# Altium schematic sheet ZB1.SchDoc
size A3; SheetNumber: 1; SheetTotal: 3
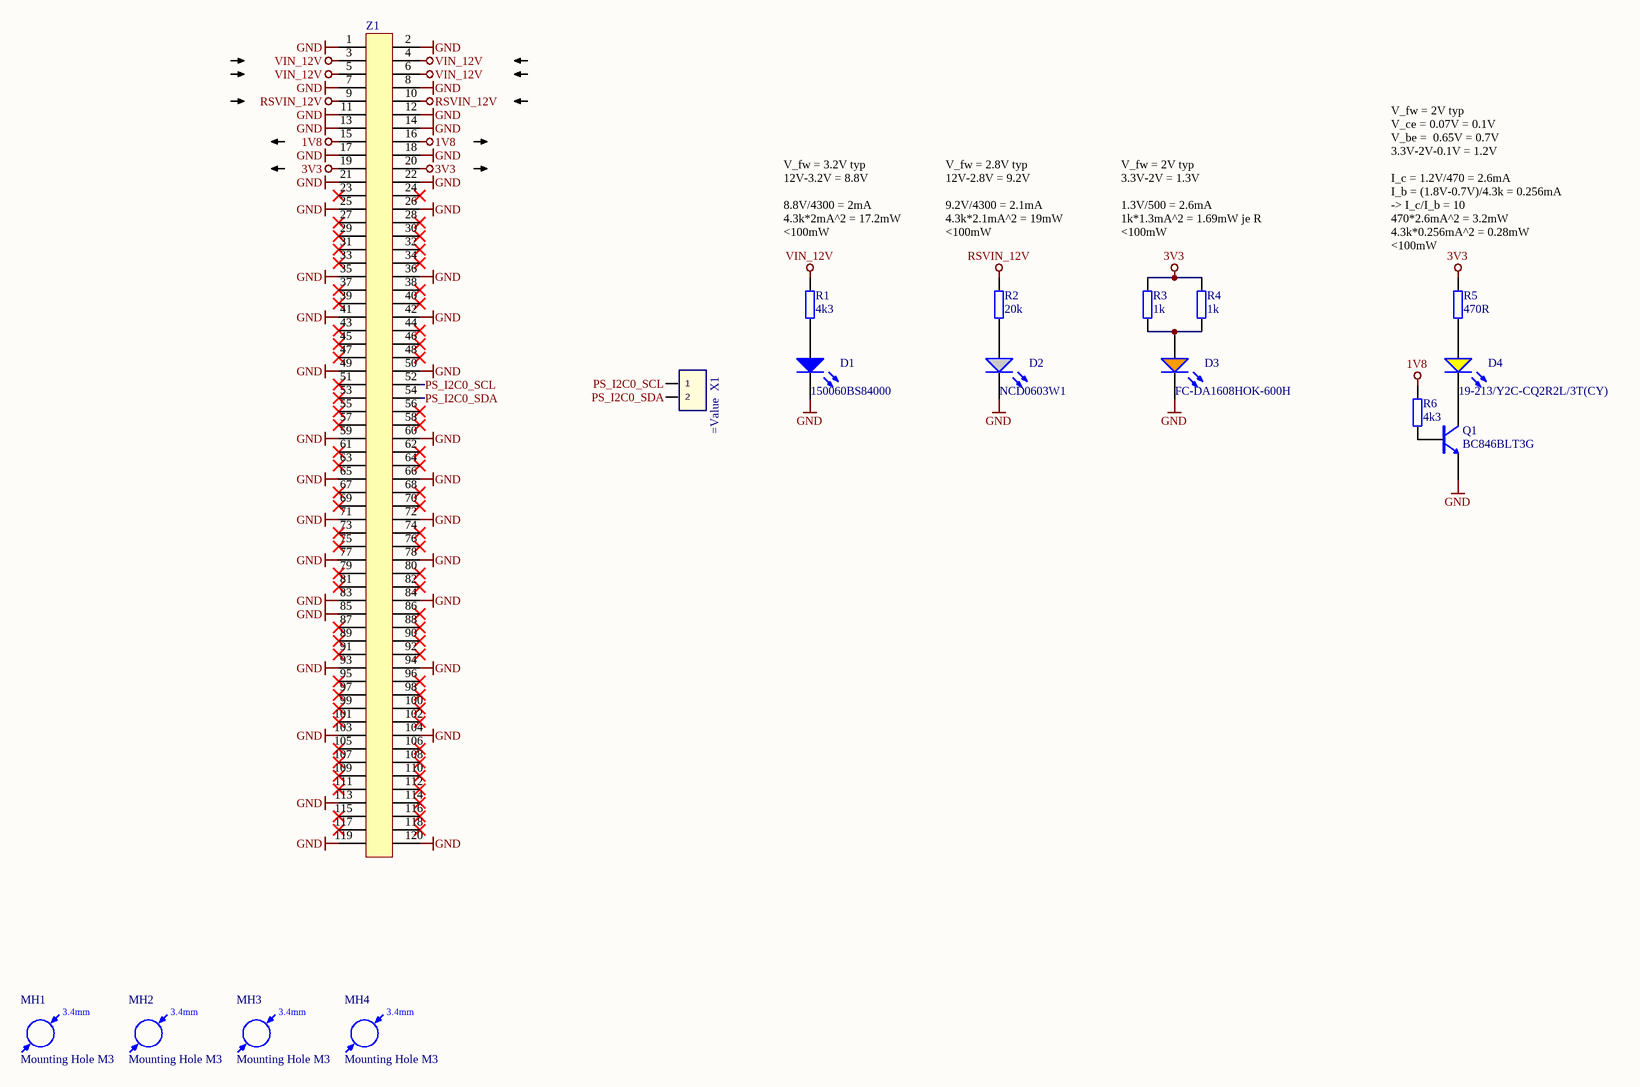
[diagram p0: ZB1.SchDoc]

## Parts
D1  150060BS84000  [WL-SMCW_0603]
D2  NCD0603W1  [WL-SMCW_0603]
D3  FC-DA1608HOK-600H  [WL-SMCW_0603]
D4  19-213/Y2C-CQ2R2L/3T(CY)  [WL-SMCW_0603]
MH1  Mounting Hole M3  [MH_3.4]  (no BOM)
MH2  Mounting Hole M3  [MH_3.4]  (no BOM)
MH3  Mounting Hole M3  [MH_3.4]  (no BOM)
MH4  Mounting Hole M3  [MH_3.4]  (no BOM)
Q1  BC846BLT3G  [SOT95P280X145-3N]
R1  4k3  [RES 0603_1608]
R2  20k  [RES 0603_1608]
R3  1k  [RES 0603_1608]
R4  1k  [RES 0603_1608]
R5  470R  [RES 0603_1608]
R6  4k3  [RES 0603_1608]
X1  (no value)  [TSW-102-XX-XXX-S]
Z1  (no value)  [ERM8-060-02.0-L-DV]

## Nets
1V8: R6.2 Z1.15 Z1.16
3V3: R3.2 R4.2 R5.2 Z1.19 Z1.20
GND: D1.1(K) D2.1(K) D3.1(K) Q1.2(EMITTER) Z1.1 Z1.2 Z1.7 Z1.8 Z1.11 Z1.12 Z1.13 Z1.14 Z1.17 Z1.18 Z1.21 Z1.22 Z1.25 Z1.26 Z1.35 Z1.36 Z1.41 Z1.42 Z1.49 Z1.50 Z1.59 Z1.60 Z1.65 Z1.66 Z1.71 Z1.72 Z1.77 Z1.78 Z1.83 Z1.84 Z1.85 Z1.93 Z1.94 Z1.103 Z1.104 Z1.113 Z1.119 Z1.120
RSVIN_12V: R2.2 Z1.9 Z1.10
VIN_12V: R1.2 Z1.3 Z1.4 Z1.5 Z1.6
PS_I2C0_SCL: X1.1 Z1.52
PS_I2C0_SDA: X1.2 Z1.54
NetD1_2: D1.2(A) R1.1
NetD2_2: D2.2(A) R2.1
NetD3_2: D3.2(A) R3.1 R4.1
NetD4_1: D4.1(K) Q1.3(COLLECTOR)
NetD4_2: D4.2(A) R5.1
NetQ1_1: Q1.1(BASIS) R6.1

Not connected (* = marked no-connect by the designer): Z1 23* 24* 27* 28* 29* 30* 31* 32* 33* 34* 37* 38* 39* 40* 43* 44* 45* 46* 47* 48* 51* 53* 55* 56* 57* 58* 61* 62* 63* 64* 67* 68* 69* 70* 73* 74* 75* 76* 79* 80* 81* 82* 86* 87* 88* 89* 90* 91* 92* 95* 96* 97* 98* 99* 100* 101* 102* 105* 106* 107* 108* 109* 110* 111* 112* 114* 115* 116* 117* 118*

## Notes on the sheet
- V_fw = 3.2V typ
  12V-3.2V = 8.8V
  8.8V/4300 = 2mA
  4.3k*2mA^2 = 17.2mW
  <100mW
- V_fw = 2.8V typ
  12V-2.8V = 9.2V
  9.2V/4300 = 2.1mA
  4.3k*2.1mA^2 = 19mW
  <100mW
- V_fw = 2V typ
  3.3V-2V = 1.3V
  1.3V/500 = 2.6mA
  1k*1.3mA^2 = 1.69mW je R
  <100mW
- (near R5) V_fw = 2V typ
  V_ce = 0.07V = 0.1V
  V_be =  0.65V = 0.7V
  3.3V-2V-0.1V = 1.2V
  I_c = 1.2V/470 = 2.6mA
  I_b = (1.8V-0.7V)/4.3k = 0.256mA
  -> I_c/I_b = 10
  470*2.6mA^2 = 3.2mW
  4.3k*0.256mA^2 = 0.28mW
  <100mW
- Title
- Revision:
- Design Engineer:
- Date:
- Project:
- Sheet
- of
- (in symbol Mounting Hole) 3.4mm

## Library data of the parts
D1 = 150060BS84000: WL-SMCW SMD Mono-color Chip LED Waterclear Blue; Manufacturer: Wuerth Elektronik; Type: Standard; Created from: MGremer; Forward Current I_f: 20 mA; Forward Voltage U_f: 3.2 V; Wavelength: 470 nm; Light Intensity: 560 mcd; Nominal Power: 78 mW; Manufacturer Part Number: 150060BS84000; PartID: 1; Created On: 08.12.2020 10:19:38; ComponentLink1Description: Datasheet; ComponentLink1URL: https://www.we-online.com/components/products/datasheet/150060BS75000.pdf; Component Type: LED Diode; Device Package: 0603; Last Updated: 22.04.2026 11:55:05; Mounting Type: SMD; Operating Temperature: -40 - 85 °C; Supplier 1: Mouser; Supplier Part Number 1: 710-150060BS84000; Supplier 2: Farnell; Supplier Part Number 2: 3408611; Supplier 3: Digi-Key; Supplier Part Number 3: 732-150060BS84000CT-ND; Live Cycle Status: 1; Stock number: not stored; Color: blue; LCSC Part Number: C5197644
D2 = NCD0603W1: White light 0603 Light Emitting Diodes (LED) ROHS; Manufacturer: Foshan NationStar Optoelectronics; Type: Standard; Created from: NDiringer; Forward Current I_f: 20 mA; Forward Voltage U_f: 2.8 V; Light Intensity: 250 mcd; Nominal Power: 72 mW; Manufacturer Part Number: NCD0603W1; PartID: 13; Created On: 03.05.2022 13:11:03; ComponentLink1Description: Datasheet; ComponentLink1URL: https://www.lcsc.com/datasheet/C84265.pdf; Component Type: LED Diode; Device Package: 0603; Last Updated: 22.04.2026 11:55:05; Mounting Type: SMD; Operating Temperature: -40 - 85 °C; Supplier 1: LCSC; Supplier Part Number 1: C84265; Live Cycle Status: 1; Stock number: not stored; Color: white; LCSC Part Number: C84265
D3 = FC-DA1608HOK-600H: LED ORANGE 600~610NM 80~220MCD@20MA TOP VIEW 0603 ROHS; Manufacturer: Foshan NationStar Optoelectronics; Type: Standard; Created from: T. Wendt; Color: amber; Forward Current I_f: 20 mA; Forward Voltage U_f: 2 V; Wavelength: 604 nm; Light Intensity: 150 mcd; Nominal Power: 40 mW; Manufacturer Part Number: FC-DA1608HOK-600H; PartID: 10; Created On: 03.03.2021 09:59:51; ComponentLink1Description: Datasheet; ComponentLink1URL: https://www.lcsc.com/datasheet/C84269.pdf; Component Type: LED Diode; Device Package: 0603; Last Updated: 22.04.2026 11:55:05; Mounting Type: SMD; Operating Temperature: -40 - 85 °C; Supplier 1: LCSC; Supplier Part Number 1: C84269; Live Cycle Status: 1; Stock number: not stored; LCSC Part Number: C84269
D4 = 19-213/Y2C-CQ2R2L/3T(CY): LED YELLOW 585.5~591.5NM 90~180MCD@20MA TOP VIEW 0603 ROHS; Manufacturer: Everlight Elec; Type: Standard; Created from: T. Wendt; Forward Current I_f: 20 mA; Forward Voltage U_f: 2 V; Wavelength: 590 nm; Light Intensity: 180 mcd; Nominal Power: 40 mW; Manufacturer Part Number: 19-213/Y2C-CQ2R2L/3T(CY); PartID: 9; Created On: 03.03.2021 10:06:23; ComponentLink1Description: Datasheet; ComponentLink1URL: https://xonstorage.z8.web.core.windows.net/pdf/everlight_19213y2ccq2r2l3tcy_apr22_xonlink.pdf; Component Type: LED Diode; Device Package: 0603; Last Updated: 22.04.2026 11:55:05; Mounting Type: SMD; Operating Temperature: -40 - 85 °C; Supplier 1: LCSC; Supplier Part Number 1: C72038; Live Cycle Status: 1; Stock number: not stored; Color: yellow; LCSC Part Number: C72038
MH1-MH4 = Mounting Hole: Created from: MHlatky; Manufacturer Part Number: Mounting Hole M3; PartID: 16; Created On: 26.01.2021 09:19:51; ComponentLink1Description: Datasheet; Component Type: Mounting Hole; Device Package: -; Last Updated: 21.03.2022 23:05:12; Manufacturer: Mounting Hole; Supplier 1: Mounting Hole; Supplier Part Number 1: Mounting Hole; Type: Mounting Hole; Value: Mounting Hole; Live Cycle Status: 1; Stock number: not stored
Q1 = BC846BLT3G: Bipolartransistor, NPN 100mA 80V; Manufacturer: onsemi; Number Of Channels: single; Collector Emitter Voltage: 65 V; Power Dissipation: 225 mW; Value: 65 V; Created from: RWeimer; Manufacturer Part Number: BC846BLT3G; PartID: 5; Created On: 13.04.2026 15:15:44; ComponentLink1Description: Datasheet; ComponentLink1URL: https://www.onsemi.com/pdf/datasheet/bc846alt1-d.pdf; Component Type: Bipolartransistor; Device Package: SOT-23-3; Last Updated: 01.06.2026 13:30:53; Mounting Type: SMD; Operating Temperature: -55 - +150°C; Series: BC846BL; Supplier 1: Mouser; Supplier Part Number 1: 863-BC846BLT3G; Supplier 2: LCSC; Supplier Part Number 2: C513271; Type: Bipolartransistor; Collector Basis Voltage: 80 V; Polarization: NPN; Live Cycle Status: 1; LCSC Part Number: C513271
R1 R6 = RK73B1JTTD432J: SMD resistor E24 series; Manufacturer: KOA Speer; Tolerance: 5%; Created from: MGremer; Manufacturer Part Number: RK73B1JTTD432J; PartID: 89; Created On: 14.12.2020 16:17:14; ComponentLink1Description: Datasheet; ComponentLink1URL: https://www.mouser.de/datasheet/2/219/RK73B-1825463.pdf; Component Type: SMD resistor; Device Package: 0603; Last Updated: 10.04.2026 07:56:16; Mounting Type: SMD; Supplier 1: Mouser; Supplier Part Number 1: 660-RK73B1JTTD432J; Type: Resistor; Value: 4k3; Live Cycle Status: 1; Stock number: Labor SMD Container; LCSC Part Number: C307285
R2 = 0603WAF2002T5E: SMD resistor E24 series; Manufacturer: UNI-ROYAL; Tolerance: 1%; Created from: AGeiger; Manufacturer Part Number: 0603WAF2002T5E; PartID: 105; Created On: 14.12.2020 16:17:14; ComponentLink1Description: Datasheet; ComponentLink1URL: https://datasheet.lcsc.com/lcsc/2206010230_UNI-ROYAL-Uniroyal-Elec-0603WAF2002T5E_C4184.pdf; Component Type: SMD resistor; Device Package: 0603; Last Updated: 25.08.2022 20:05:50; Mounting Type: SMD; Supplier 1: LCSC; Supplier Part Number 1: C4184; Type: Resistor; Value: 20k; Live Cycle Status: 1; Stock number: Labor SMD Container; LCSC Part Number: C4184
R3 R4 = 0603WAF1001T5E: SMD resistor E24 series; Manufacturer: UNI-ROYAL; Tolerance: 1%; Created from: AGeiger; Manufacturer Part Number: 0603WAF1001T5E; PartID: 74; Created On: 14.12.2020 16:17:14; ComponentLink1Description: Datasheet; ComponentLink1URL: https://datasheet.lcsc.com/lcsc/2206010130_UNI-ROYAL-Uniroyal-Elec-0603WAF1001T5E_C21190.pdf; Component Type: SMD resistor; Device Package: 0603; Last Updated: 25.08.2022 16:01:46; Mounting Type: SMD; Supplier 1: LCSC; Supplier Part Number 1: C21190; Type: Resistor; Value: 1k; Live Cycle Status: 1; Stock number: Labor SMD Container; LCSC Part Number: C21190
R5 = RK73B1JTTD471J: SMD resistor E24 series; Manufacturer: KOA Speer; Tolerance: 5%; Created from: MGremer; Manufacturer Part Number: RK73B1JTTD471J; PartID: 66; Created On: 14.12.2020 16:17:14; ComponentLink1Description: Datasheet; ComponentLink1URL: https://www.mouser.de/datasheet/2/219/RK73B-1825463.pdf; Component Type: SMD resistor; Device Package: 0603; Last Updated: 04.03.2021 10:03:02; Mounting Type: SMD; Supplier 1: Mouser; Supplier Part Number 1: 660-RK73B1JTTD471J; Supplier 2: LCSC; Supplier Part Number 2: C23179; Type: Resistor; Value: 470R; Live Cycle Status: 1; Stock number: Labor SMD Container; LCSC Part Number: C23179
X1 = TSW-102-07-L-S: Classic PCB Header Strips, 0.100" pitch; MANUFACTURER: SAMTEC; Created from: AGeiger; CREATED BY: May 18, 2016 - Wendy Xin; PCB DECAL: TSW-102-XX-XXX-S; LCSC Part Number: C492401; Manufacturer Part Number: TSW-102-07-L-S; PartID: 20; Created On: 26.06.2023 09:51:05; ComponentLink1Description: Datasheet; ComponentLink1URL: https://suddendocs.samtec.com/catalog_english/tsw_th.pdf; Last Updated: 26.06.2023 09:53:59; Mounting Type: SMD; Operating Temperature: -55 °C to +105 °C; Series: TSW; Supplier 1: LCSC; Supplier Part Number 1: C492401; Value: TSW-102-07-L-S
Z1 = ERM8-060-02.0-L-DV-TR: 0.80 mm Edge Rate Rugged High Speed; Manufacturer: SAMTEC; Created from: AGeiger; Manufacturer Part Number: ERM8-060-02.0-L-DV-TR; PartID: 61; Created On: 15.08.2025 09:35:44; ComponentLink1Description: Datasheet; ComponentLink1URL: https://suddendocs.samtec.com/catalog_english/erm8.pdf; Last Updated: 23.09.2025 10:14:21; Mounting Type: SMD; Operating Temperature: -55 °C to +125 °C; Series: ERM8; Supplier 1: LCSC; Supplier Part Number 1: C3649339; Value: ERM8-060-02.0-L-DV-TR; LCSC Part Number: C3649339